# Altium project WiCAN.PrjPcb
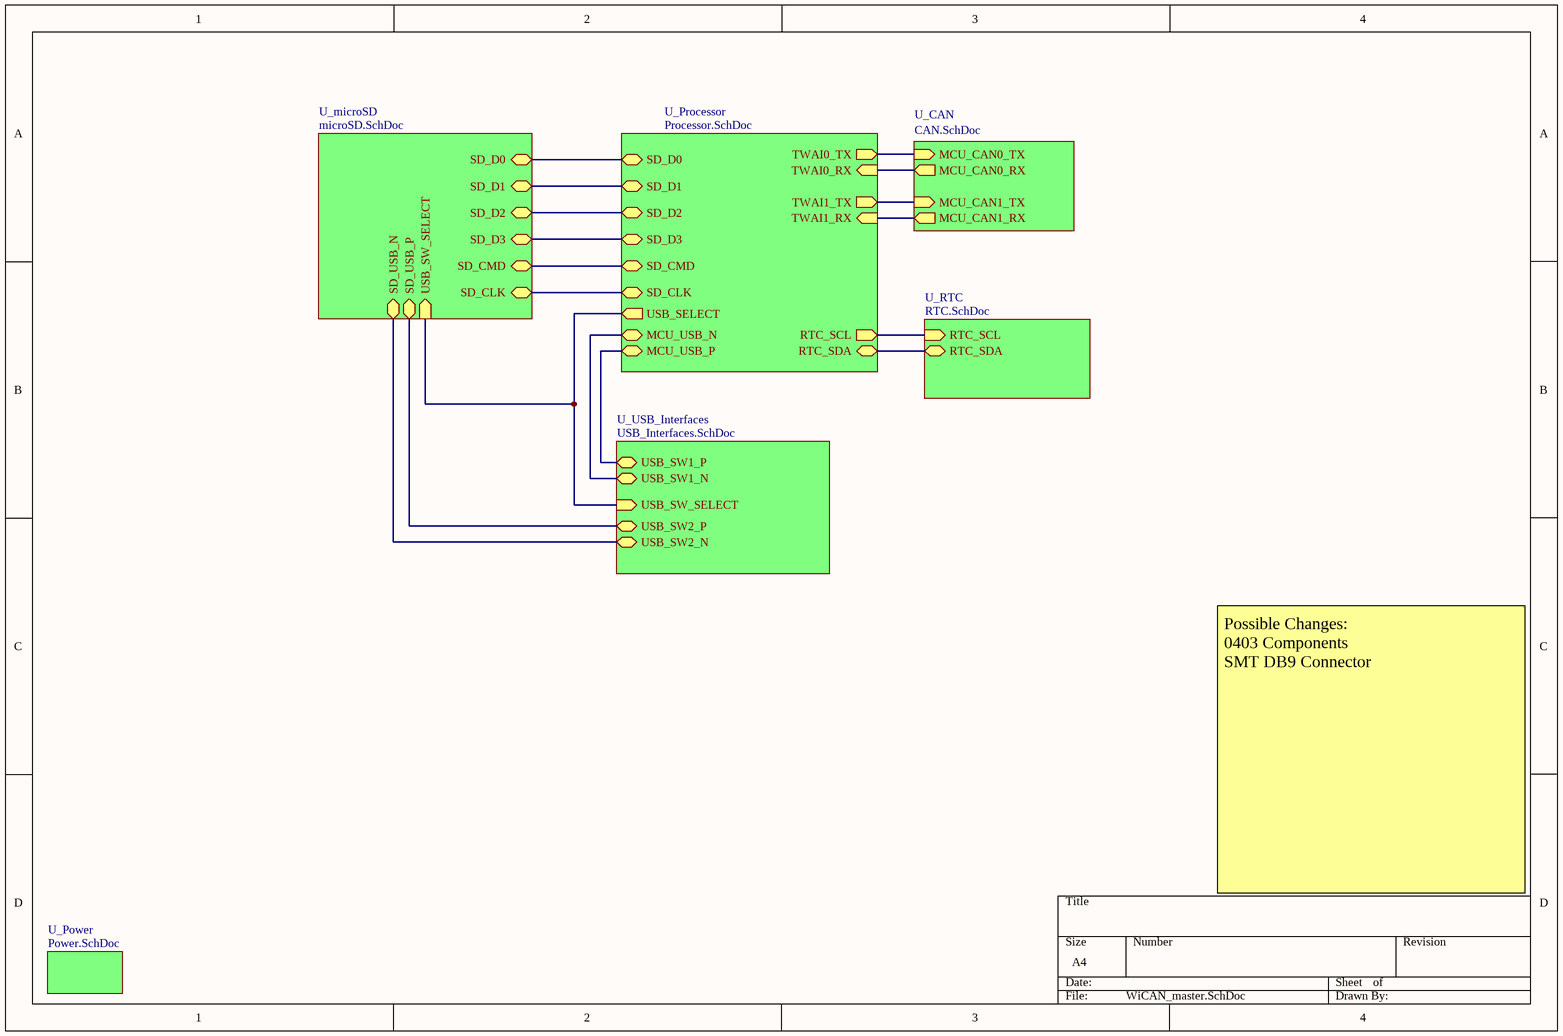
[diagram p0: WiCAN_master.SchDoc]
7 sheets, 77 parts. Net scope: hierarchical (ports join the sheet entries above them; power ports are global).
Sheets:
  WiCAN_master.SchDoc
    U_Processor = Processor.SchDoc
    U_microSD = microSD.SchDoc
    U_CAN = CAN.SchDoc
    U_RTC = RTC.SchDoc
    U_USB_Interfaces = USB_Interfaces.SchDoc
    U_Power = Power.SchDoc

## Sheet WiCAN_master.SchDoc
size A4; SheetNumber: 1; SheetTotal: 6

### Sub-sheets
U_CAN = CAN.SchDoc: MCU_CAN0_TX (in), MCU_CAN0_RX (out), MCU_CAN1_TX (in), MCU_CAN1_RX (out)
U_microSD = microSD.SchDoc: SD_D0 (bidir), SD_D1 (bidir), SD_D2 (bidir), SD_D3 (bidir), SD_CMD (bidir), SD_CLK (bidir), SD_USB_P (bidir), SD_USB_N (bidir), USB_SW_SELECT (in)
U_Power = Power.SchDoc: no entries
U_Processor = Processor.SchDoc: SD_D0 (bidir), SD_D1 (bidir), SD_D2 (bidir), SD_D3 (bidir), SD_CMD (bidir), SD_CLK (bidir), RTC_SDA (bidir), TWAI0_TX (out), TWAI0_RX (in), TWAI1_TX (out), TWAI1_RX (in), MCU_USB_N (bidir), MCU_USB_P (bidir), USB_SELECT (out), RTC_SCL (out)
U_RTC = RTC.SchDoc: RTC_SCL (in), RTC_SDA (bidir)
U_USB_Interfaces = USB_Interfaces.SchDoc: USB_SW2_P (bidir), USB_SW2_N (bidir), USB_SW1_P (bidir), USB_SW1_N (bidir), USB_SW_SELECT (in)

### Nets
MCU_USB_N: sheet U_Processor/MCU_USB_N, sheet U_USB_Interfaces/USB_SW1_N
MCU_USB_P: sheet U_Processor/MCU_USB_P, sheet U_USB_Interfaces/USB_SW1_P
RTC_SCL: sheet U_Processor/RTC_SCL, sheet U_RTC/RTC_SCL
RTC_SDA: sheet U_Processor/RTC_SDA, sheet U_RTC/RTC_SDA
SD_CLK: sheet U_Processor/SD_CLK, sheet U_microSD/SD_CLK
SD_CMD: sheet U_Processor/SD_CMD, sheet U_microSD/SD_CMD
SD_D0: sheet U_Processor/SD_D0, sheet U_microSD/SD_D0
SD_D1: sheet U_Processor/SD_D1, sheet U_microSD/SD_D1
SD_D2: sheet U_Processor/SD_D2, sheet U_microSD/SD_D2
SD_D3: sheet U_Processor/SD_D3, sheet U_microSD/SD_D3
SD_RESET_N: sheet U_Processor/USB_SELECT, sheet U_microSD/USB_SW_SELECT, sheet U_USB_Interfaces/USB_SW_SELECT
SD_USB_N: sheet U_microSD/SD_USB_N, sheet U_USB_Interfaces/USB_SW2_N
SD_USB_P: sheet U_microSD/SD_USB_P, sheet U_USB_Interfaces/USB_SW2_P
NetIC1_9: sheet U_Processor/TWAI0_TX, sheet U_CAN/MCU_CAN0_TX
NetIC1_10: sheet U_Processor/TWAI0_RX, sheet U_CAN/MCU_CAN0_RX
NetIC1_12: sheet U_Processor/TWAI1_TX, sheet U_CAN/MCU_CAN1_TX
NetIC1_13: sheet U_Processor/TWAI1_RX, sheet U_CAN/MCU_CAN1_RX

### Notes on the sheet
- Possible Changes:
  0403 Components
  SMT DB9 Connector

## Sheet Processor.SchDoc
size A4; SheetNumber: 2; SheetTotal: 7; SPICEModelCacheYJUROCZO: <root> / <DocumentId>YJUROCZO</DocumentId> / <CacheFrame Number="0"> / <Model Name="umk107bj105_a-t" Kind="CKT"> / <Text>* UMK107BJ105_A-T     SPICE MODEL  ( General Type ) / *-------------------------------------------------------------------------------------------------------- / * Model Generated by TAIYO YUDEN Corporation (http://www.ty-top.com) / * Version 1.0 / * TAIYO YUDEN Control No. 170508_130520 / * Copyright(c) 2012 TAIYO YUDEN CO.,LTD. All Rights Reserved. / *-------------------------------------------------------------------------------------------------------- / * / * Products Name : Multilayer Ceramic Capacitors / * / * Characteristics : / *     Capacitance : 1 uF , Rated Voltage : 50V , TCC : X5R / *     Case Size : 1.6 x 0.8 / 0.063 x 0.031 [mm/inch] , Thickness : 0.8 / 0.031 [mm/inch] / *     (Conditions: Temperature = 25 degC , DC Bias Current/Voltage = 0A / 0V) / * / * Frequency Range : 40Hz - 3GHz / * / * External Node Assignments : / * / *  1  o---| |---o  2 / * / *-------------------------------------------------------------------------------------------------------- / .SubCkt UMK107BJ105_A-T 1 2 / **************************** / C0 1 110 0.79929u / Cm 1 101 0.13681u / C1 101 102 0.26224u / Rc1 101 102 5.8806k / C2 102 103 0.057839u / Rc2 102 103 469.42 / C3 103 110 0.014568u / Rc3 103 110 14.853 / C2m 1 301 0.13283u / C21 301 302 1.2593u / Rc21 301 302 6.3079k / C22 302 303 1.1189u / Rc22 302 303 6.9405k / C23 303 304 1.1421u / Rc23 303 304 6.4848k / C24 304 305 0.36861u / Rc24 304 305 785 / C25 305 306 0.39327u / Rc25 305 306 637.41 / C26 306 307 0.27451u / Rc26 306 307 19.365 / C27 307 308 0.15295u / Rc27 307 308 23.239 / C28 308 309 0.17569u / Rc28 308 309 17.788 / C29 309 110 1420.6p / Rc29 309 110 1.9725 / Rp0 1 110 500Meg / L0 110 120 0.24088n / Lm 120 130 0.1369n / L1 120 121 0.1842n / RL1 121 130 0.29804 / L2 120 122 0.40657n / RL2 122 130 0.57395 / L3 120 123 0.85773n / RL3 123 130 0.82282 / CR 120 124 0.11463u / LR 124 125 0.25983n / RR 125 130 52.447m / CL 130 140 1.4637p / LL 130 140 0.23986n / RL 130 140 33.985 / Rs 140 2 6.8539m / **************************** / .ends UMK107BJ105_A-T</Text> / </Model> / </CacheFrame> / </root>
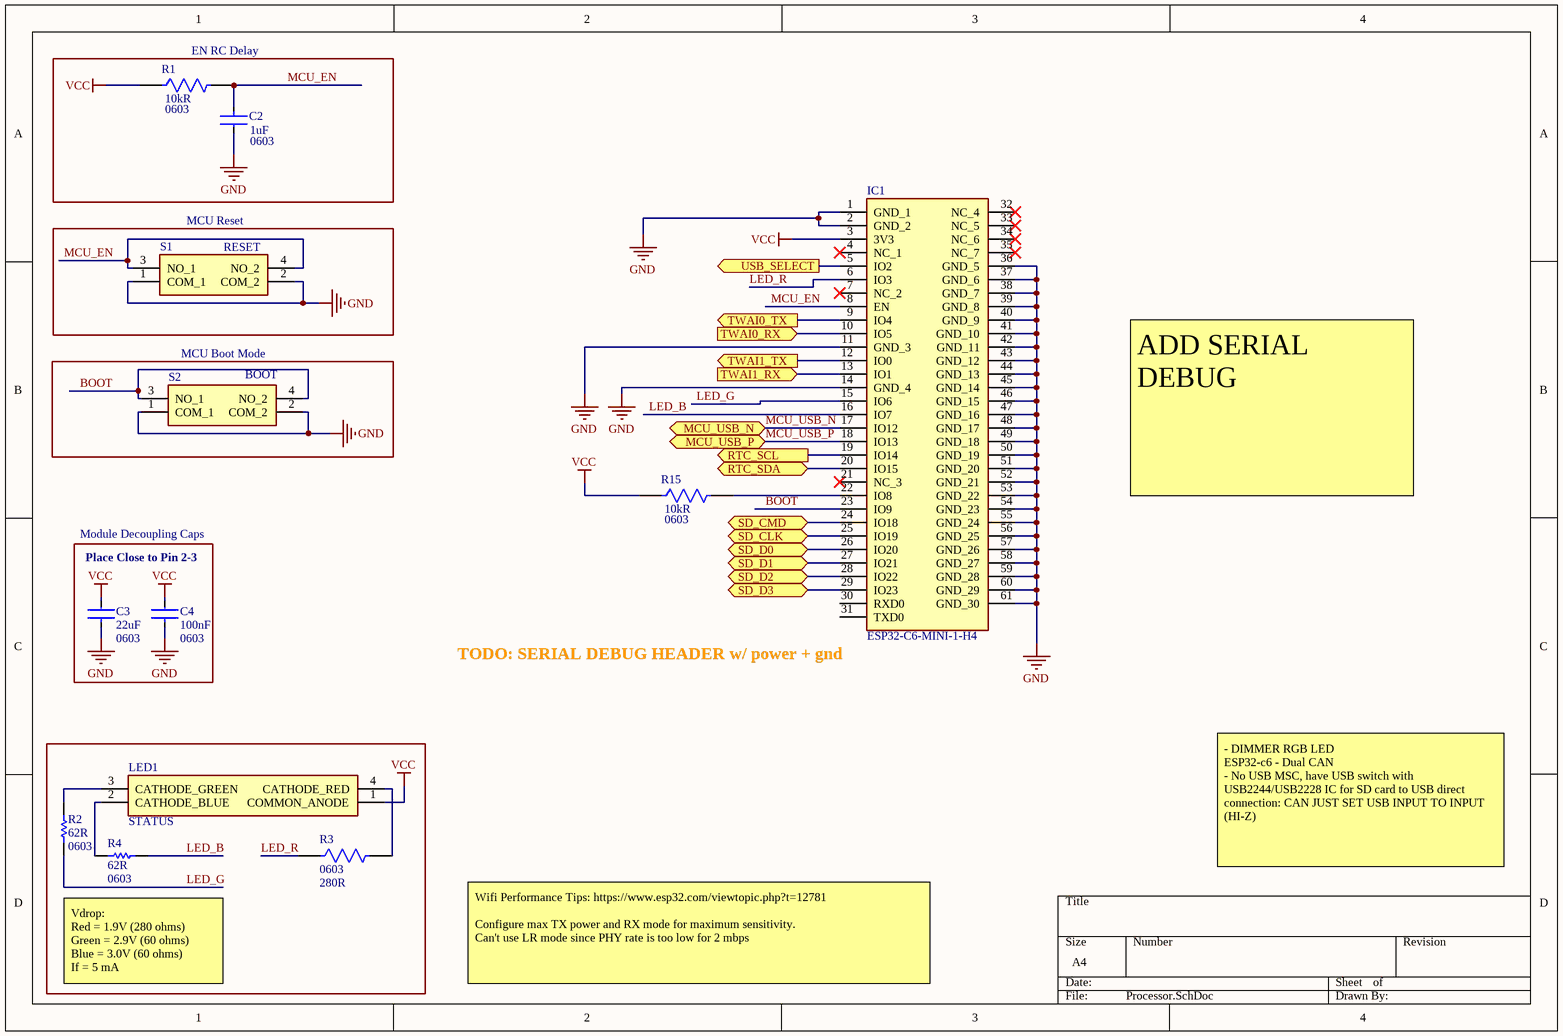
[diagram p1: Processor.SchDoc]

### Parts
C2  Case/Package: 0603  Capacitance: 1uF  [FP-0603-L_1_6_0_1-W_0_8_0-IPC_A]  (hidden comment: UMK107BJ105KA-T)
C3  Capacitance: 22uF  Case Code (Imperial): 0603  [FP-GRM188-0_2-IPC_C]  (hidden comment: GRM188R61A226ME15D)
C4  Capacitance: 100nF  Case/Package: 0603  [FP-CL10-IPC_A]  (hidden comment: CL10B104KB8WPNC)
IC1  ESP32-C6-MINI-1-H4  [ESP32C6MINI1H4]
LED1  STATUS  [CLMVCFKACL1D1L71BB7C3C3]
R1  Case Code (Imperial): 0603  Resistance: 10kR  [FP-RMCF0603-MFG]  (hidden comment: RMCF0603JG10K0)
R2  Resistance: 62R  Package: 0603  [RESC1608X55X30ML15T15]  (hidden comment: ERJ-3GEYJ620V)
R3  Case/Package: 0603  Resistance: 280R  [FP-RMCF0603-MFG]  (hidden comment: RMCF0603FT280R)
R4  Resistance: 62R  Package: 0603  [RESC1608X55X30ML15T15]  (hidden comment: ERJ-3GEYJ620V)
R15  Case Code (Imperial): 0603  Resistance: 10kR  [FP-RMCF0603-MFG]  (hidden comment: RMCF0603JG10K0)
S1  RESET  [PTS526SM15SMTR2LFS]
S2  BOOT  [PTS526SM15SMTR2LFS]

### Blocks framed on the sheet
EN RC Delay: C2 R1
MCU Reset: S1
MCU Boot Mode: S2

### Ports
MCU_USB_N (bidir), MCU_USB_P (bidir), RTC_SCL (out), RTC_SDA (bidir), SD_CLK (bidir), SD_CMD (bidir), SD_D0 (bidir), SD_D1 (bidir), SD_D2 (bidir), SD_D3 (bidir), TWAI0_RX (in), TWAI0_TX (out), TWAI1_RX (in), TWAI1_TX (out), USB_SELECT (out)

### Nets
GND: C2.2 C3.1 C4.1 IC1.1(GND_1) IC1.2(GND_2) IC1.11(GND_3) IC1.14(GND_4) IC1.36(GND_5) IC1.37(GND_6) IC1.38(GND_7) IC1.39(GND_8) IC1.40(GND_9) IC1.41(GND_10) IC1.42(GND_11) IC1.43(GND_12) IC1.44(GND_13) IC1.45(GND_14) IC1.46(GND_15) IC1.47(GND_16) IC1.48(GND_17) IC1.49(GND_18) IC1.50(GND_19) IC1.51(GND_20) IC1.52(GND_21) IC1.53(GND_22) IC1.54(GND_23) IC1.55(GND_24) IC1.56(GND_25) IC1.57(GND_26) IC1.58(GND_27) IC1.59(GND_28) IC1.60(GND_29) IC1.61(GND_30) S1.1(COM_1) S1.2(COM_2) S2.1(COM_1) S2.2(COM_2)
VCC: C3.2 C4.2 IC1.3(3V3) LED1.1(COMMON_ANODE) R1.1 R15.1
BOOT: IC1.23(IO9) S2.3(NO_1) S2.4(NO_2)
LED_B: IC1.16(IO7) R4.2
LED_G: IC1.15(IO6) R2.2
LED_R: IC1.6(IO3) R3.1
MCU_EN: C2.1 IC1.8(EN) R1.2 S1.3(NO_1) S1.4(NO_2)
MCU_USB_N: IC1.17(IO12) ; port MCU_USB_N
MCU_USB_P: IC1.18(IO13) ; port MCU_USB_P
RTC_SCL: IC1.19(IO14) ; port RTC_SCL
RTC_SDA: IC1.20(IO15) ; port RTC_SDA
SD_CLK: IC1.25(IO19) ; port SD_CLK
SD_CMD: IC1.24(IO18) ; port SD_CMD
SD_D0: IC1.26(IO20) ; port SD_D0
SD_D1: IC1.27(IO21) ; port SD_D1
SD_D2: IC1.28(IO22) ; port SD_D2
SD_D3: IC1.29(IO23) ; port SD_D3
SD_RESET_N: IC1.5(IO2) ; port USB_SELECT
NetIC1_9: IC1.9(IO4) ; port TWAI0_TX
NetIC1_10: IC1.10(IO5) ; port TWAI0_RX
NetIC1_12: IC1.12(IO0) ; port TWAI1_TX
NetIC1_13: IC1.13(IO1) ; port TWAI1_RX
NetIC1_22: IC1.22(IO8) R15.2
NetLED1_2: LED1.2(CATHODE_BLUE) R4.1
NetLED1_3: LED1.3(CATHODE_GREEN) R2.1
NetLED1_4: LED1.4(CATHODE_RED) R3.2

Not connected (* = marked no-connect by the designer): IC1 4(NC_1)* 7(NC_2)* 21(NC_3)* 30(RXD0) 31(TXD0) 32(NC_4)* 33(NC_5)* 34(NC_6)* 35(NC_7)*

### Notes on the sheet
- ADD SERIAL DEBUG
- Module Decoupling Caps
- Place Close to Pin 2-3
- TODO: SERIAL DEBUG HEADER w/ power + gnd
- - DIMMER RGB LED
  ESP32-c6 - Dual CAN
  - No USB MSC, have USB switch with USB2244/USB2228 IC for SD card to USB direct connection: CAN JUST SET USB INPUT TO INPUT (HI-Z)
- Vdrop:
  Red = 1.9V (280 ohms)
  Green = 2.9V (60 ohms)
  Blue = 3.0V (60 ohms)
  If = 5 mA
- Wifi Performance Tips: https://www.esp32.com/viewtopic.php?t=12781
  Configure max TX power and RX mode for maximum sensitivity.
  Can't use LR mode since PHY rate is too low for 2 mbps

### Library data of the parts
C2 = CMP-2000-05447-3: None; Tolerance: 10%; Voltage Rating: 50V; Dielectric: X5R; Height: 0.8mm; Depth: 0.8mm; Number of Pins: 2; Length: 1.6mm; Thickness: 0.035inch; Contact Plating: Nickel; Radiation Hardening: No; Package Quantity: 1; Halogen Free: Halogen Free; RoHS Compliant: Yes; Termination: SMD/SMT; Max Operating Temperature: 85°C; Min Operating Temperature: -55°C; Case Code (Metric): 1608; Construction: Flat; Voltage Rating (DC): 50V; Packaging: Tape and Reel; Series: M; Case Code (Imperial): 0603; Width: 0.031inch; Mount: Surface Mount
C3 = CMP-2000-06337-3: Chip Multilayer Ceramic Capacitors for General Purpose, 0603, 22uF, X5R, 15%, 20%, 10V; Tolerance: 20%; Weight: 0.000222oz; Material: Ceramic; Depth: 0.8mm; Length: 1.6mm; Termination: SMD/SMT; Packaging: Tape and Reel; Width: 0.8mm; Voltage Rating: 10V; Mount: Surface Mount; Voltage Rating (DC): 10V; Case/Package: 0603; Thickness: 0.039inch; REACH SVHC: No SVHC; Dielectric: X5R; Height: 0.8mm; Package Quantity: 4000; Case Code (Metric): 1608; Min Operating Temperature: -55°C; Lead Free: Lead Free; Max Operating Temperature: 85°C
C4 = CMP-13271-002353-1: Cap Ceramic 100nF 50V X7R ±10% Pad SMD 0603 +125°C T/R; Ratings: AEC-Q200; Features: Soft Termination; Max Operating Temperature: 125°C; Mount: Surface Mount; Width: 0.031inch; Voltage Rating: 50V; Case Code (Metric): 1608; Case Code (Imperial): 0603; Tolerance: 10%; Min Operating Temperature: -55°C; Thickness: 0.035inch; Lead Free: Lead Free; Packaging: Tape and Reel; Length: 0.063inch
IC1 = ESP32-C6-MINI-1-H4: Integrated Circuit; Manufacturer_Name: Espressif Systems; Datasheet Link: https://www.espressif.com/sites/default/files/documentation/esp32-c6-mini-1_mini-1u_datasheet_en.pdf; Height: 2.55mm; Manufacturer_Part_Number: ESP32-C6-MINI-1-H4; Mouser Part Number: 356-ESP32C6MINI1-H4; Mouser Price/Stock: https://www.mouser.co.uk/ProductDetail/Espressif-Systems/ESP32-C6-MINI-1-H4?qs=Jm2GQyTW%2Fbgg5ClQiAJNHw%3D%3D
LED1 = CLMVC-FKA-CL1D1L71BB7C3C3: LED; Manufacturer_Name: Wolfspeed; Datasheet Link: https://www.cree.com/led-components/media/documents/1273-CLMVC-FKA.pdf; Height: 1mm; Manufacturer_Part_Number: CLMVC-FKA-CL1D1L71BB7C3C3; Mouser Part Number: 941-CLMVCFKACL1D1L71; Mouser Price/Stock: https://www.mouser.co.uk/ProductDetail/Cree-LED/CLMVC-FKA-CL1D1L71BB7C3C3?qs=fSnNYG2PaKLJAXXrLOgMiQ%3D%3D; Arrow Part Number: CLMVC-FKA-CL1D1L71BB7C3C3; Arrow Price/Stock: https://www.arrow.com/en/products/clmvc-fka-cl1d1l71bb7c3c3/cree-led?region=nac
R1 R15 = CMP-26527-000153-1: 10kΩ ±5% 0.1W 0603 Thick Film Chip Resistor AEC-Q200 compliant; Temperature Coefficient: 200ppm/°C; Max Power Dissipation: 100mW; Tolerance: 5%; Series: RMCF; Resistor Type: Thick Film; Length: 0.061inch; Features: Automotive AEC-Q200; Height: 0.022inch; Case Code (Metric): 1608; Width: 0.031inch; Number of Terminations: 2; Contact Plating: Tin; Case/Package: 0603; Package Quantity: 1; Max Operating Temperature: 155°C; Mount: Surface Mount; RoHS Compliant: Yes; Radiation Hardening: No; Min Operating Temperature: -55°C; Packaging: Tape and Reel
R2 R4 = CMP-1012-00045-2: Manufacturer: Panasonic; Part Number: ERJ-3GEYJ620V
R3 = CMP-26527-006784-1: 280Ω ±1% 0.1W 0603 Thick Film Chip Resistor AEC-Q200 compliant; Max Power Dissipation: 100mW; Temperature Coefficient: 100ppm/°C; RoHS Compliant: Yes; Height: 0.022inch; Resistor Type: Thick Film; Case Code (Metric): 1608; Radiation Hardening: No; Contact Plating: Tin; Series: RMCF; Features: Automotive AEC-Q200; Number of Terminations: 2; Tolerance: 1%; Packaging: Tape and Reel; Max Operating Temperature: 155°C; Min Operating Temperature: -55°C; Length: 0.061inch; Lead Free: Lead Free; Width: 0.031inch; Mount: Surface Mount; Case Code (Imperial): 0603
S1 S2 = PTS526_SM15_SMTR2_LFS: Switch; Manufacturer_Name: C & K COMPONENTS; Manufacturer_Part_Number: PTS526 SM15 SMTR2 LFS; Datasheet Link: https://www.mouser.com/datasheet/2/60/pts526-1651200.pdf; Height: 1.5mm; Mouser Part Number: 611-PTS526SM15SMTR2L; Mouser Price/Stock: https://www.mouser.co.uk/ProductDetail/CK/PTS526-SM15-SMTR2-LFS?qs=UXgszm6BlbENivbslIA%252B5g%3D%3D; Arrow Part Number: PTS526 SM15 SMTR2 LFS; Arrow Price/Stock: https://www.arrow.com/en/products/pts526-sm15-smtr2-lfs/ck?region=nac

## Sheet microSD.SchDoc
size A4; SheetNumber: 6; SheetTotal: 6; SPICEModelCacheQHUFGKIC: <root> / <DocumentId>QHUFGKIC</DocumentId> / <CacheFrame Number="0"> / <Model Name="umk107bj105_a-t" Kind="CKT"> / <Text>* UMK107BJ105_A-T     SPICE MODEL  ( General Type ) / *-------------------------------------------------------------------------------------------------------- / * Model Generated by TAIYO YUDEN Corporation (http://www.ty-top.com) / * Version 1.0 / * TAIYO YUDEN Control No. 170508_130520 / * Copyright(c) 2012 TAIYO YUDEN CO.,LTD. All Rights Reserved. / *-------------------------------------------------------------------------------------------------------- / * / * Products Name : Multilayer Ceramic Capacitors / * / * Characteristics : / *     Capacitance : 1 uF , Rated Voltage : 50V , TCC : X5R / *     Case Size : 1.6 x 0.8 / 0.063 x 0.031 [mm/inch] , Thickness : 0.8 / 0.031 [mm/inch] / *     (Conditions: Temperature = 25 degC , DC Bias Current/Voltage = 0A / 0V) / * / * Frequency Range : 40Hz - 3GHz / * / * External Node Assignments : / * / *  1  o---| |---o  2 / * / *-------------------------------------------------------------------------------------------------------- / .SubCkt UMK107BJ105_A-T 1 2 / **************************** / C0 1 110 0.79929u / Cm 1 101 0.13681u / C1 101 102 0.26224u / Rc1 101 102 5.8806k / C2 102 103 0.057839u / Rc2 102 103 469.42 / C3 103 110 0.014568u / Rc3 103 110 14.853 / C2m 1 301 0.13283u / C21 301 302 1.2593u / Rc21 301 302 6.3079k / C22 302 303 1.1189u / Rc22 302 303 6.9405k / C23 303 304 1.1421u / Rc23 303 304 6.4848k / C24 304 305 0.36861u / Rc24 304 305 785 / C25 305 306 0.39327u / Rc25 305 306 637.41 / C26 306 307 0.27451u / Rc26 306 307 19.365 / C27 307 308 0.15295u / Rc27 307 308 23.239 / C28 308 309 0.17569u / Rc28 308 309 17.788 / C29 309 110 1420.6p / Rc29 309 110 1.9725 / Rp0 1 110 500Meg / L0 110 120 0.24088n / Lm 120 130 0.1369n / L1 120 121 0.1842n / RL1 121 130 0.29804 / L2 120 122 0.40657n / RL2 122 130 0.57395 / L3 120 123 0.85773n / RL3 123 130 0.82282 / CR 120 124 0.11463u / LR 124 125 0.25983n / RR 125 130 52.447m / CL 130 140 1.4637p / LL 130 140 0.23986n / RL 130 140 33.985 / Rs 140 2 6.8539m / **************************** / .ends UMK107BJ105_A-T</Text> / </Model> / </CacheFrame> / </root>
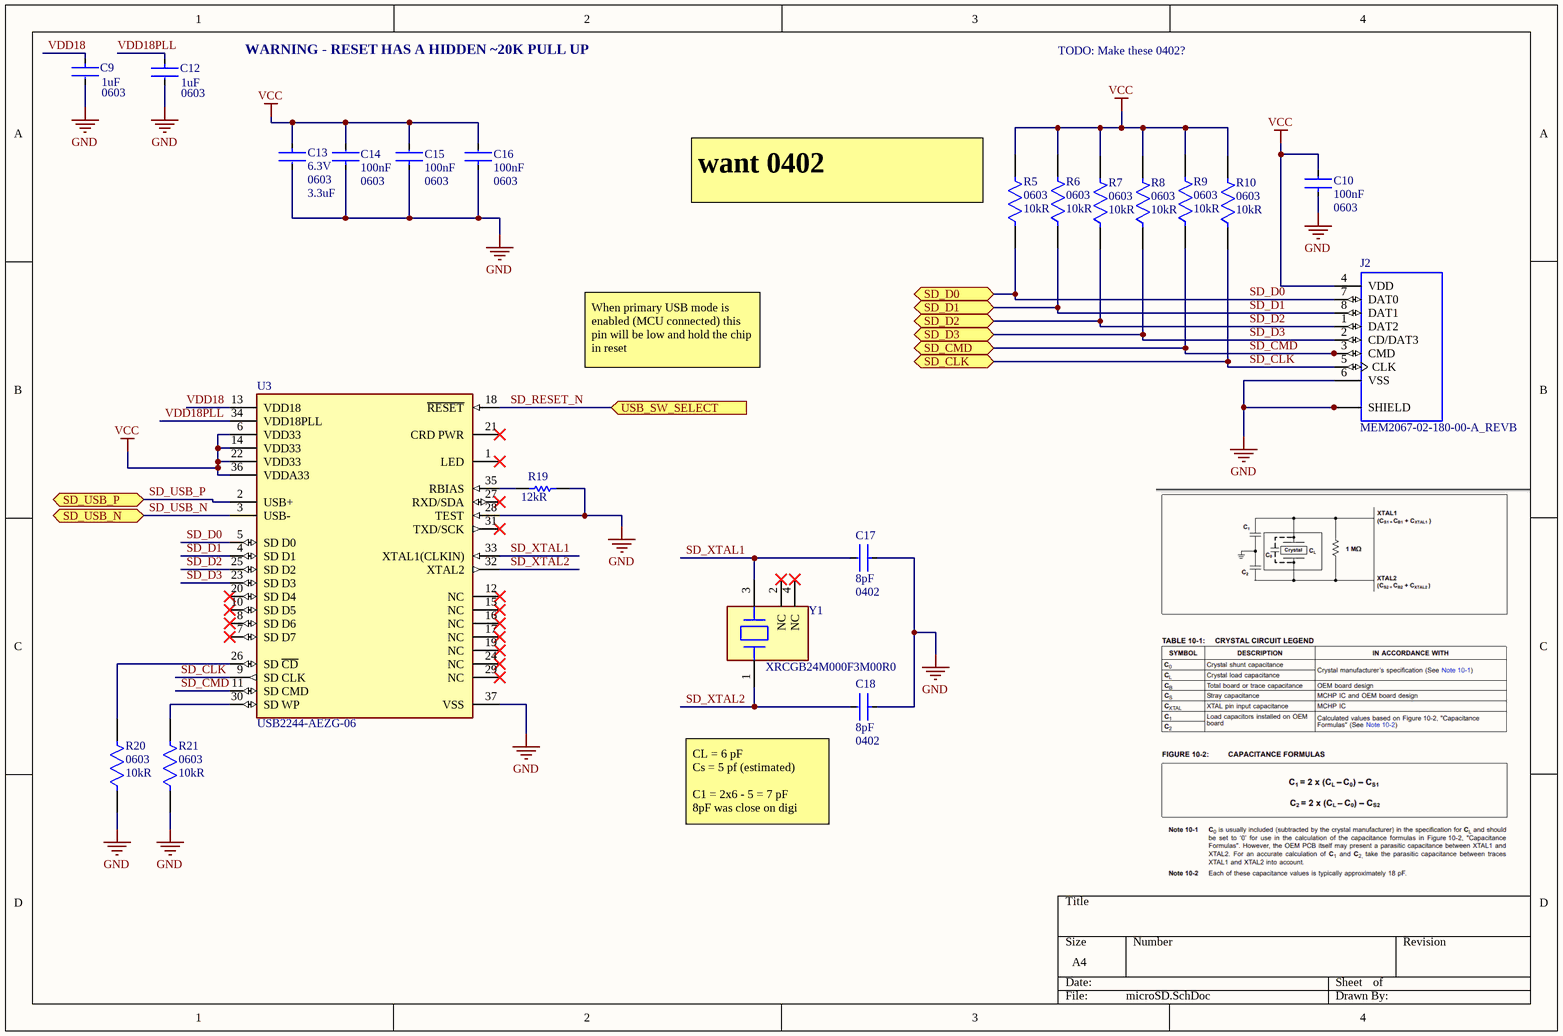
[diagram p2: microSD.SchDoc]

### Parts
C9  Case/Package: 0603  Capacitance: 1uF  [FP-0603-L_1_6_0_1-W_0_8_0-IPC_A]  (hidden comment: UMK107BJ105KA-T)
C10  Capacitance: 100nF  Case/Package: 0603  [FP-CL10-IPC_A]  (hidden comment: CL10B104KB8WPNC)
C12  Case/Package: 0603  Capacitance: 1uF  [FP-0603-L_1_6_0_1-W_0_8_0-IPC_A]  (hidden comment: UMK107BJ105KA-T)
C13  Voltage Rating: 6.3V  Case Code (Imperial): 0603  Capacitance: 3.3uF  [FP-C1608-080-0_1-MFG]  (hidden comment: C1608X7S0J335K080AC)
C14  Capacitance: 100nF  Case/Package: 0603  [FP-CL10-IPC_A]  (hidden comment: CL10B104KB8WPNC)
C15  Capacitance: 100nF  Case/Package: 0603  [FP-CL10-IPC_A]  (hidden comment: CL10B104KB8WPNC)
C16  Capacitance: 100nF  Case/Package: 0603  [FP-CL10-IPC_A]  (hidden comment: CL10B104KB8WPNC)
C17  Capacitance: 8pF  Package: 0402  [FP-CL522-IPC_C]  (hidden comment: CL05C080DB51PNC)
C18  Capacitance: 8pF  Package: 0402  [FP-CL522-IPC_C]  (hidden comment: CL05C080DB51PNC)
J2  MEM2067-02-180-00-A_REVB  [GCT_MEM2067-02-180-00-A_REVB]
R5  Case Code (Imperial): 0603  Resistance: 10kR  [FP-RMCF0603-MFG]  (hidden comment: RMCF0603JG10K0)
R6  Case Code (Imperial): 0603  Resistance: 10kR  [FP-RMCF0603-MFG]  (hidden comment: RMCF0603JG10K0)
R7  Case Code (Imperial): 0603  Resistance: 10kR  [FP-RMCF0603-MFG]  (hidden comment: RMCF0603JG10K0)
R8  Case Code (Imperial): 0603  Resistance: 10kR  [FP-RMCF0603-MFG]  (hidden comment: RMCF0603JG10K0)
R9  Case Code (Imperial): 0603  Resistance: 10kR  [FP-RMCF0603-MFG]  (hidden comment: RMCF0603JG10K0)
R10  Case Code (Imperial): 0603  Resistance: 10kR  [FP-RMCF0603-MFG]  (hidden comment: RMCF0603JG10K0)
R19  Resistance: 12kR  [RESC1608X55X25LL10T15]  (hidden comment: RC0603FR-1312KL)
R20  Case Code (Imperial): 0603  Resistance: 10kR  [FP-RMCF0603-MFG]  (hidden comment: RMCF0603JG10K0)
R21  Case Code (Imperial): 0603  Resistance: 10kR  [FP-RMCF0603-MFG]  (hidden comment: RMCF0603JG10K0)
U3  USB2244-AEZG-06  [FP-36QFN-4106-6x6B-MFG]
Y1  XRCGB24M000F3M00R0  [FP-XRCGB_F_N-MFG]

### Ports
SD_CLK (bidir), SD_CMD (bidir), SD_D0 (bidir), SD_D1 (bidir), SD_D2 (bidir), SD_D3 (bidir), SD_USB_N (bidir), SD_USB_P (bidir), USB_SW_SELECT (in)

### Nets
GND: C9.2 C10.1 C12.2 C13.1 C14.1 C15.1 C16.1 C17.1 C18.1 J2.6(VSS) J2.9(SHIELD) J2.10(SHIELD) J2.11(SHIELD) J2.12(SHIELD) R19.2 R20.1 R21.1 U3.28(TEST) U3.37(VSS)
VCC: C10.2 C13.2 C14.2 C15.2 C16.2 J2.4(VDD) R5.2 R6.2 R7.2 R8.2 R9.2 R10.2 U3.6(VDD33) U3.14(VDD33) U3.22(VDD33) U3.36(VDDA33)
SD_CLK: J2.5(CLK) R10.1 U3.9(SD_CLK) ; port SD_CLK
SD_CMD: J2.3(CMD) R9.1 U3.11(SD_CMD) ; port SD_CMD
SD_D0: J2.7(DAT0) R5.1 U3.5(SD_D0) ; port SD_D0
SD_D1: J2.8(DAT1) R6.1 U3.4(SD_D1) ; port SD_D1
SD_D2: J2.1(DAT2) R7.1 U3.25(SD_D2) ; port SD_D2
SD_D3: J2.2(CD/DAT3) R8.1 U3.23(SD_D3) ; port SD_D3
SD_RESET_N: U3.18(~{RESET}) ; port USB_SW_SELECT
SD_USB_N: U3.3(USB-) ; port SD_USB_N
SD_USB_P: U3.2(USB+) ; port SD_USB_P
SD_XTAL1: C17.2 U3.33(XTAL1(CLKIN)) Y1.3(2_Input/Output)
SD_XTAL2: C18.2 U3.32(XTAL2) Y1.1(1_Input/Output)
VDD18: C9.1 U3.13(VDD18)
VDD18PLL: C12.1 U3.34(VDD18PLL)
NetR19_1: R19.1 U3.35(RBIAS)
NetR20_2: R20.2 U3.26(SD_~{CD})
NetR21_2: R21.2 U3.30(SD_WP)

Not connected (* = marked no-connect by the designer): U3 1(LED)* 7(SD_D7)* 8(SD_D6)* 10(SD_D5)* 12(NC)* 15(NC)* 16(NC)* 17(NC)* 19(NC)* 20(SD_D4)* 21(CRD_PWR)* 24(NC)* 27(RXD/SDA)* 29(NC)* 31(TXD/SCK)*; Y1 2(NC)* 4(NC)*

### Notes on the sheet
- WARNING - RESET HAS A HIDDEN ~20K PULL UP
- TODO: Make these 0402?
- (near R5) want 0402
- When primary USB mode is enabled (MCU connected) this pin will be low and hold the chip in reset
- (near C18) CL = 6 pF
  Cs = 5 pf (estimated)
  C1 = 2x6 - 5 = 7 pF
  8pF was close on digi

### Library data of the parts
C9 C12 = CMP-2000-05447-3: as C2 on sheet Processor; Height: 0.8mm; Depth: 0.8mm; Number of Pins: 2; Length: 1.6mm; Thickness: 0.035inch; Contact Plating: Nickel; Radiation Hardening: No; Package Quantity: 1; Halogen Free: Halogen Free; RoHS Compliant: Yes; Termination: SMD/SMT; Max Operating Temperature: 85°C; Min Operating Temperature: -55°C; Case Code (Metric): 1608; Construction: Flat; Voltage Rating (DC): 50V; Packaging: Tape and Reel; Series: M; Case Code (Imperial): 0603; Width: 0.031inch; Mount: Surface Mount
C10 C14-C16 = CMP-13271-002353-1: as C4 on sheet Processor; Ratings: AEC-Q200; Features: Soft Termination; Max Operating Temperature: 125°C; Mount: Surface Mount; Width: 0.031inch; Voltage Rating: 50V; Case Code (Metric): 1608; Case Code (Imperial): 0603; Tolerance: 10%; Min Operating Temperature: -55°C; Thickness: 0.035inch; Lead Free: Lead Free; Packaging: Tape and Reel; Length: 0.063inch
C13 = CMP-08246-006760-1: Multilayer Ceramic Capacitors 3.3μF ±10% 6.3V X7S SMD 0603; Max Operating Temperature: 125°C; Lead Free: Lead Free; Min Operating Temperature: -55°C; Dielectric Material: Ceramic; Voltage Rating (DC): 6.3V; Case/Package: 0603; Thickness: 0.035inch; RoHS Compliant: Yes; Mount: Surface Mount; Width: 0.031inch; Tolerance: 10%; Case Code (Metric): 1608; Package Quantity: 4000; Series: C; Length: 0.063inch; Packaging: Tape and Reel
C17 C18 = CMP-13271-000662-1: Cap Ceramic 8pF 50V C0G ±0.5pF SMD 0402 +125°C Paper T/R
J2 = MEM2067-02-180-00-A_REVB: Micro SD Memory Card ConnectorSMT, Hinged, 1.80mm Profile; Value: *; MP: MEM2067-02-180-00-A_REVB; Package: None; Availability: Unavailable; Price: None
R5-R10 R20 R21 = CMP-26527-000153-1: as R1 on sheet Processor; Tolerance: 5%; Series: RMCF; Resistor Type: Thick Film; Length: 0.061inch; Features: Automotive AEC-Q200; Height: 0.022inch; Case Code (Metric): 1608; Width: 0.031inch; Number of Terminations: 2; Contact Plating: Tin; Case/Package: 0603; Package Quantity: 1; Max Operating Temperature: 155°C; Mount: Surface Mount; RoHS Compliant: Yes; Radiation Hardening: No; Min Operating Temperature: -55°C; Packaging: Tape and Reel
R19 = CMP-2000-04198-1: Manufacturer: Yageo; Part Number: RC0603FR-1312KL
U3 = CMP-06284-000024-1: IC MEDIA CTRLR USB 2.0 36-QFNE3; Data Rate: 35Mbps; Number of Transceivers: 1; Max Supply Voltage: 3.6V; Operating Supply Voltage: 3.3V; Min Supply Voltage: 3V; Operating Supply Current: 135mA; Interface: Serial; Mount: Surface Mount; Case/Package: QFN; Height: 0.95mm; Max Operating Temperature: 70°C; Lead Free: Lead Free; Package Quantity: 490; Width: 6.15mm; Min Operating Temperature: 0°C; Radiation Hardening: No; REACH SVHC: No SVHC; Length: 6.15mm; Number of Pins: 36; RoHS Compliant: Yes; Series: *; Packaging: Tray
Y1 = CMP-06054-000017-1: CRYSTAL 24.0000MHZ 6PF SMD; ESR (Equivalent Series Resistance): 150R; Operating Frequency: 24 MHz; Tolerance: 30ppm; Frequency: 24MHz; Frequency Stability: 40ppm; Length: 2mm; Height: 0.028inch; Lead Free: Lead Free; Min Operating Temperature: -30°C; REACH SVHC: No SVHC; RoHS Compliant: Yes; Series Resistance: 150R; Mount: Surface Mount; Packaging: Tape and Reel; Termination: SMD/SMT; Case/Package: SMD/SMT; Max Operating Temperature: 85°C; Width: 1.6mm; Number of Pins: 4; Load Capacitance: 6pF; Package Quantity: 1; Depth: 1.6mm; Frequency Tolerance: 30ppm; Series: XRCGB

## Sheet CAN.SchDoc
size A4; SheetNumber: 4; SheetTotal: 6
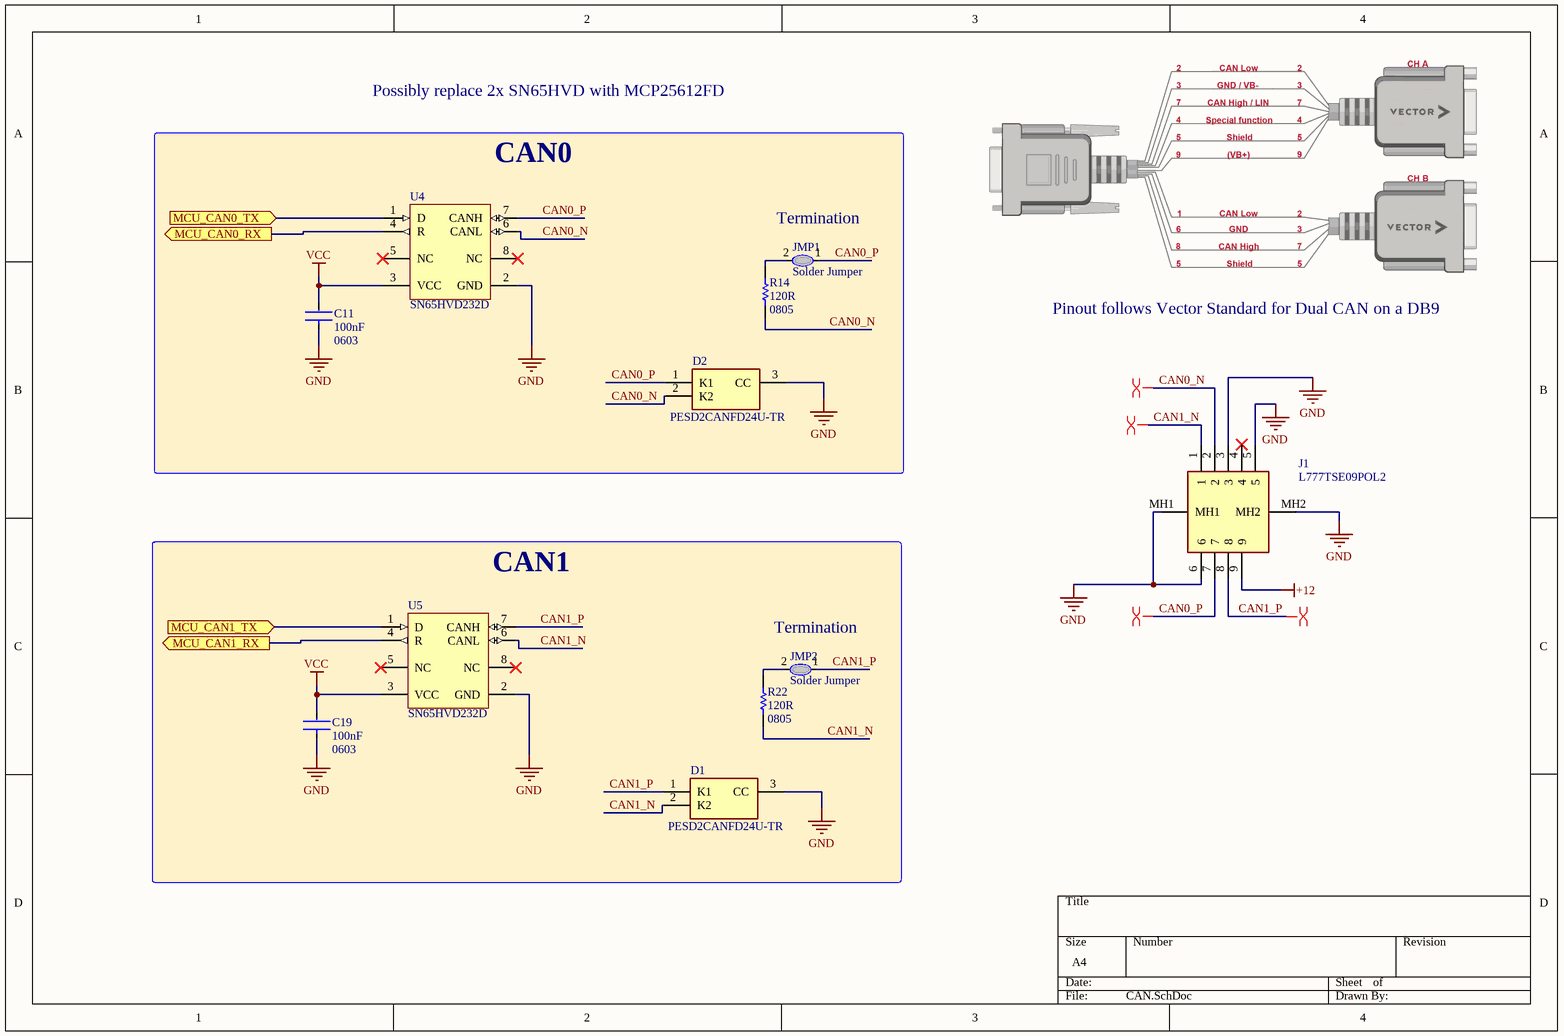
[diagram p3: CAN.SchDoc]

### Parts
C11  Capacitance: 100nF  Case/Package: 0603  [FP-CL10-IPC_A]  (hidden comment: CL10B104KB8WPNC)
C19  Capacitance: 100nF  Case/Package: 0603  [FP-CL10-IPC_A]  (hidden comment: CL10B104KB8WPNC)
D1  PESD2CANFD24U-TR  [SOT95P230X110-3N]
D2  PESD2CANFD24U-TR  [SOT95P230X110-3N]
J1  L777TSE09POL2  [L777TSE09POL2]
JMP1  Solder Jumper  [Solder Jumper]
JMP2  Solder Jumper  [Solder Jumper]
R14  Resistance: 120R  Package: 0805  [RESC2013X70X40LL20T20]  (hidden comment: ERJ-P06J121V)
R22  Resistance: 120R  Package: 0805  [RESC2013X70X40LL20T20]  (hidden comment: ERJ-P06J121V)
U4  SN65HVD232D  [D0008A_L]
U5  SN65HVD232D  [D0008A_L]

### Blocks framed on the sheet
CAN0: C11 D2 JMP1 R14 U4
CAN1: C19 D1 JMP2 R22 U5

### Ports
MCU_CAN0_RX (out), MCU_CAN0_TX (in), MCU_CAN1_RX (out), MCU_CAN1_TX (in)

### Nets
+12: J1.9
GND: C11.1 C19.1 D1.3(CC) D2.3(CC) J1.3 J1.5 J1.6 J1.MH1 J1.MH2 U4.2(GND) U5.2(GND)
VCC: C11.2 C19.2 U4.3(VCC) U5.3(VCC)
CAN0_N: D2.2(K2) J1.2 R14.2 U4.6(CANL)
CAN0_P: D2.1(K1) J1.7 JMP1.1 U4.7(CANH)
CAN1_N: D1.2(K2) J1.1 R22.2 U5.6(CANL)
CAN1_P: D1.1(K1) J1.8 JMP2.1 U5.7(CANH)
NetIC1_9: U4.1(D) ; port MCU_CAN0_TX
NetIC1_10: U4.4(R) ; port MCU_CAN0_RX
NetIC1_12: U5.1(D) ; port MCU_CAN1_TX
NetIC1_13: U5.4(R) ; port MCU_CAN1_RX
NetJMP1_2: JMP1.2 R14.1
NetJMP2_2: JMP2.2 R22.1

Not connected (* = marked no-connect by the designer): J1 4*; U4 5(NC)* 8(NC)*; U5 5(NC)* 8(NC)*

### Layout directives
differential pair: CAN0_N, CAN0_P, CAN1_N, CAN1_P

### Notes on the sheet
- Possibly replace 2x SN65HVD with MCP25612FD
- Termination
- Pinout follows Vector Standard for Dual CAN on a DB9

### Library data of the parts
C11 C19 = CMP-13271-002353-1: as C4 on sheet Processor; Ratings: AEC-Q200; Features: Soft Termination; Max Operating Temperature: 125°C; Mount: Surface Mount; Width: 0.031inch; Voltage Rating: 50V; Case Code (Metric): 1608; Case Code (Imperial): 0603; Tolerance: 10%; Min Operating Temperature: -55°C; Thickness: 0.035inch; Lead Free: Lead Free; Packaging: Tape and Reel; Length: 0.063inch
D1 D2 = PESD2CANFD24U-TR: Diode; Manufacturer_Name: Nexperia; Datasheet Link: https://assets.nexperia.com/documents/data-sheet/PESD2CANFD24U-T.pdf; Height: 1.1mm; Manufacturer_Part_Number: PESD2CANFD24U-TR; Mouser Part Number: 771-PESD2CANFD24U-TR; Mouser Price/Stock: https://www.mouser.co.uk/ProductDetail/Nexperia/PESD2CANFD24U-TR?qs=vmHwEFxEFR%252BPr2so13o7KA%3D%3D; Arrow Part Number: PESD2CANFD24U-TR; Arrow Price/Stock: https://www.arrow.com/en/products/pesd2canfd24u-tr/nexperia
J1 = L777TSE09POL2: Connector; Manufacturer_Name: Amphenol; Datasheet Link: https://cdn.amphenol-cs.com/media/wysiwyg/files/drawing/l777tsxxxpol2.pdf; Height: 12.22mm; Manufacturer_Part_Number: L777TSE09POL2; Mouser Part Number: 523-L777TSE09POL2; Mouser Price/Stock: https://www.mouser.co.uk/ProductDetail/Amphenol-Commercial-Products/L777TSE09POL2?qs=8nwx9VzGl4xjIfY3UQTpgw%3D%3D
R14 R22 = CMP-2001-00481-1: Manufacturer: Panasonic; Part Number: ERJ-P06J121V
U4 U5 = CMP-0315-00073-2: 3.3 V CAN Transceiver, 17 mA, -40 to 85 degC, 8-pin SOIC (D), Green (RoHS & no Sb/Br); Manufacturer: Texas Instruments; Supply Voltage(s)(V): 3.3; Transient Pulse Protection(V): -25 to 25; ICC(Max)(mA): 17; Drivers Per Package: 1; Rating: Catalog; Code_JEDEC: MS-012AA; Mounting Technology: Surface Mount; PackageDescription: 8-Pin Plastic Small Outline Integrated Circuit, 4.9 x 3.9 mm, Pitch 1.27 mm Pitch; SubFamily: CAN; PackageVersion: revM, Jun-2011; Isolated: No; DatasheetVersion: SLOS346K; PackageReference: D0008A; Receivers Per Package: 1; Footprint: SN65HVD232; ComponentLink1Description: Datasheet; PartNumber: SN65HVD232D; Eco-Plan: Green (RoHS & no Sb/Br); ComponentLink1URL: http://www.ti.com/general/docs/lit/getliterature.tsp?genericPartNumber=SN65HVD232&fileType=pdf

## Sheet RTC.SchDoc
size A4; SheetNumber: 4; SheetTotal: 7; SPICEModelCacheIPIYUYAV: <root> / <DocumentId>IPIYUYAV</DocumentId> / </root>
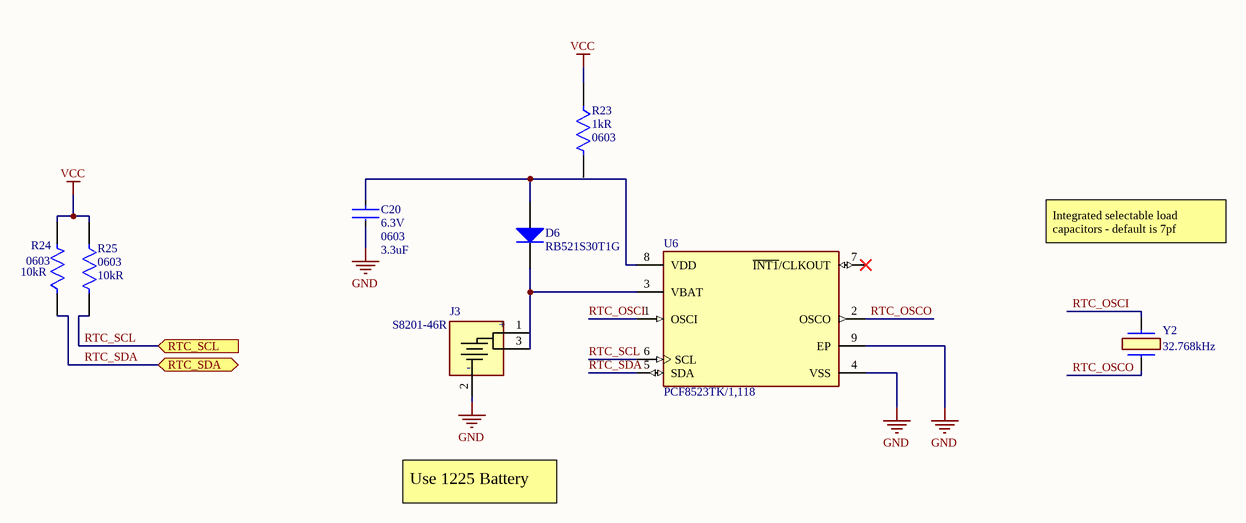
[diagram p4: RTC.SchDoc]

### Parts
C20  Voltage Rating: 6.3V  Case Code (Imperial): 0603  Capacitance: 3.3uF  [FP-C1608-080-0_1-MFG]  (hidden comment: C1608X7S0J335K080AC)
D6  RB521S30T1G  [ONSC-SOD-523-2-502-01_V]
J3  S8201-46R  [S8201-46R]
R23  Resistance: 1kR  Size Code: 0603  [FP-RC0603-0_55-IPC_C]  (hidden comment: RC0603FR-071KL)
R24  Case Code (Imperial): 0603  Resistance: 10kR  [FP-RMCF0603-MFG]  (hidden comment: RMCF0603JG10K0)
R25  Case Code (Imperial): 0603  Resistance: 10kR  [FP-RMCF0603-MFG]  (hidden comment: RMCF0603JG10K0)
U6  PCF8523TK/1,118  [FP-SOT909-1-MFG]
Y2  Frequency: 32.768kHz  [CM8V32768TA020125]  (hidden comment: CM8V-T1A-32.768kHz-7pF-20PPM-TA-QC)

### Ports
RTC_SCL (in), RTC_SDA (bidir)

### Nets
GND: C20.1 J3.2 U6.4(VSS) U6.9(EP)
VCC: R23.1 R24.2 R25.1
RTC_OSCI: U6.1(OSCI) Y2.?1
RTC_OSCO: U6.2(OSCO) Y2.2(X2)
RTC_SCL: R25.2 U6.6(SCL) ; port RTC_SCL
RTC_SDA: R24.1 U6.5(SDA) ; port RTC_SDA
NetC20_2: C20.2 D6.2(A) U6.8(VDD)
NetD6_1: D6.1(K) J3.1 J3.3 U6.3(VBAT)

Not connected (* = marked no-connect by the designer): R23 2; U6 7(~{INT1}/CLKOUT)*

### Notes on the sheet
- Integrated selectable load capacitors - default is 7pf
- Use 1225 Battery
- (in symbol S8201-46R) +; -

### Library data of the parts
C20 = CMP-08246-006760-1: as C13 on sheet microSD; Max Operating Temperature: 125°C; Lead Free: Lead Free; Min Operating Temperature: -55°C; Dielectric Material: Ceramic; Voltage Rating (DC): 6.3V; Case/Package: 0603; Thickness: 0.035inch; RoHS Compliant: Yes; Mount: Surface Mount; Width: 0.031inch; Tolerance: 10%; Case Code (Metric): 1608; Package Quantity: 4000; Series: C; Length: 0.063inch; Packaging: Tape and Reel
D6 = CMP-1051-00018-1: Schottky Barrier Diode, 2-Pin SOD-523, Pb-Free, Tape and Reel; Manufacturer: On Semiconductor; Configuration: Single; IFSM Max (A): 1; Mounting Technology: Surface Mount; ComponentLink1Description: Manufacturer URL; PackageReference: SOD-523-2-502-01; RoHS: TRUE; ComponentLink3Description: Package Specification; ComponentLink2Description: Datasheet; PackageVersion: Rev. E, 09/2010; PartNumber: RB521S30T1G; ComponentLink3URL: http://www.onsemi.com/pub_link/Collateral/502-01.PDF; ComponentLink1URL: http://www.onsemi.com/; PackageDescription: 2-Pin SOD, Body 1.2 x 0.8 mm; DatasheetVersion: Rev. 8; ComponentLink2URL: http://www.onsemi.cn/pub_link/Collateral/RB521S30T1-D.PDF; Packing: Tape and Reel
J3 = S8201-46R: Connector; Manufacturer_Name: Harwin; Datasheet Link: https://cdn.harwin.com/pdfs/S8201R.pdf; Manufacturer_Part_Number: S8201-46R; Mouser Part Number: 855-S8201-46R; Mouser Price/Stock: https://www.mouser.co.uk/ProductDetail/Harwin/S8201-46R?qs=UmERj8vReOlBAjlRZWzWbg%3D%3D
R23 = CMP-1659-00009-5: RES 1K OHM 1% 1/10W 0603; Voltage Rating: 50V; Power Rating: 100mW; Temperature Coefficient: 100ppm/°C; Military Standard: Not; REACH SVHC: No SVHC; Features: Moisture Resistant; Number of Terminations: 2; Technology: THICK FILM; Series: RC; Case Code (Metric): 1608; Resistance Tolerance: 1%; Resistor Type: Thick Film; Termination: SMD/SMT; Contact Plating: Tin; Radiation Hardening: No; Min Operating Temperature: -55°C; Max Operating Temperature: 155°C; Packaging: Tape and Reel; Max Power Dissipation: 100mW; RoHS Compliant: Yes; Height: 0.45mm; Lead Free: Lead Free; Case/Package: 0603; Length: 1.6mm; Tolerance: 1%; Case Code (Imperial): 0603; Construction: Rectangular; Depth: 0.8mm
R24 R25 = CMP-26527-000153-1: as R1 on sheet Processor; Tolerance: 5%; Series: RMCF; Resistor Type: Thick Film; Length: 0.061inch; Features: Automotive AEC-Q200; Height: 0.022inch; Case Code (Metric): 1608; Width: 0.031inch; Number of Terminations: 2; Contact Plating: Tin; Case/Package: 0603; Package Quantity: 1; Max Operating Temperature: 155°C; Mount: Surface Mount; RoHS Compliant: Yes; Radiation Hardening: No; Min Operating Temperature: -55°C; Packaging: Tape and Reel
U6 = CMP-10083-000004-1: IC RTC CLK/CALENDAR I2C 8-HVSON; Manufacturer: NXP Semiconductors; Standoff Height: 0mm; Nominal Supply Current: 0.15-1.2uA; Number Of Outputs: 1; Min Supply Voltage: 1V; Max Supply Voltage: 5.5V; Category: IC; Ipc Land Pattern Name: DFN400X400X100-8; Manufacturer Part Number: PCF8523TK/1,118; Temperature Range Low: -40°C; Automotive: No; Package: SOT909-1; Height: 1mm; Ambient Temperature Range High: +85°C; Digikey Description: IC RTC CLK/CALENDAR I2C 8-HVSON; Device Class L3: Real Time Clocks; Device Class L1: Integrated Circuits (ICs); Temperature Range High: +85°C; Device Class L2: Clock and Timing; Ambient Temperature Range Low: -40°C; Interface: I2C; Temperature: -40°C to +85°C; ComponentLink2Description: Datasheet; Octopart: https://octopart.com/pcf8523tk%2F1%2C118-nxp+semiconductors-19647992; Mouser Description: Real Time Clock REAL-TIME CLOCK (RTC) AND CALENDAR; Footprint Url: https://www.nxp.com/docs/en/package-information/SOT909-1.pdf; RoHS: TRUE; ComponentLink2URL: https://www.nxp.com/docs/en/data-sheet/PCF8523.pdf; Lead Free: Yes
Y2 = CM8V-T1A-32.768kHz-7pF-20PPM-TA-QC: Crystal or Oscillator; Manufacturer_Name: Micro Crystal AG; Datasheet Link: https://www.mouser.de/datasheet/2/530/CM8V_T1A-1510858.pdf; Height: 0.6mm; Manufacturer_Part_Number: CM8V-T1A-32.768kHz-7pF-20PPM-TA-QC; Mouser Part Number: 428-201436-MC01; Mouser Price/Stock: https://www.mouser.co.uk/ProductDetail/Micro-Crystal/CM8V-T1A-32.768kHz-7pF-20PPM-TA-QC?qs=7bTaA%2FLYtSYyZWzzv04BxA%3D%3D; Arrow Part Number: CM8V-T1A-32.768KHZ-7PF-20PPM-TA-QC; Arrow Price/Stock: https://www.arrow.com/en/products/cm8v-t1a-32.768khz-7pf-20ppm-ta-qc/micro-crystal-ag?region=nac

## Sheet USB_Interfaces.SchDoc
size A4; SheetNumber: 7; SheetTotal: 6
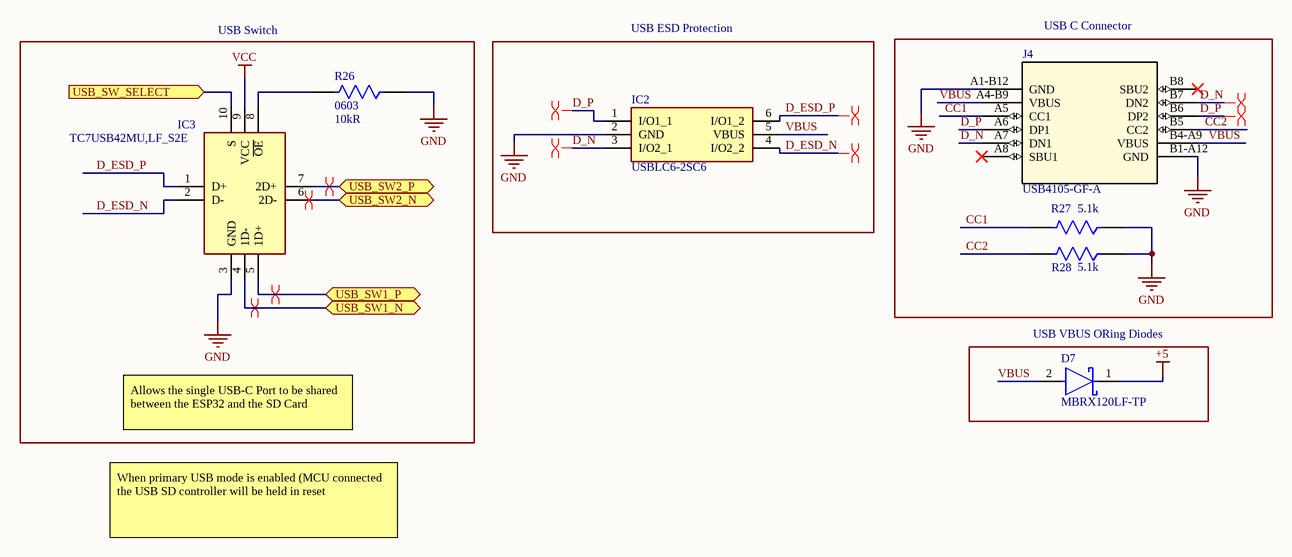
[diagram p5: USB_Interfaces.SchDoc]

### Parts
D7  MBRX120LF-TP  [FP-SOD-123-IPC_A]
IC2  USBLC6-2SC6  [SOT95P280X145-6N]
IC3  TC7USB42MU,LF_S2E  [TC7USB42MULFS2E]
J4  USB4105-GF-A  [USB4105_GCT]
R26  Case Code (Imperial): 0603  Resistance: 10kR  [FP-RMCF0603-MFG]  (hidden comment: RMCF0603JG10K0)
R27  Resistor: 5.1k  [FP-AC0603-MFG]  (hidden comment: AC0603FR-135K1L)
R28  Resistor: 5.1k  [FP-AC0603-MFG]  (hidden comment: AC0603FR-135K1L)

### Blocks framed on the sheet
USB Switch: IC3 R26
USB ESD Protection: IC2
USB C Connector: J4 R27 R28
USB VBUS ORing Diodes: D7

### Ports
USB_SW1_N (bidir), USB_SW1_P (bidir), USB_SW2_N (bidir), USB_SW2_P (bidir), USB_SW_SELECT (in)

### Nets
+5: D7.1(C)
GND: IC2.2(GND) IC3.3(GND) J4.A1-B12(GND) J4.B1-A12(GND) R26.1 R27.1 R28.1
VCC: IC3.9(VCC)
CC1: J4.A5(CC1) R27.2
CC2: J4.B5(CC2) R28.2
D_ESD_N: IC2.4(I/O2_2) IC3.2(D-)
D_ESD_P: IC2.6(I/O1_2) IC3.1(D+)
D_N: IC2.3(I/O2_1) J4.A7(DN1) J4.B7(DN2)
D_P: IC2.1(I/O1_1) J4.A6(DP1) J4.B6(DP2)
MCU_USB_N: IC3.4(1D-) ; port USB_SW1_N
MCU_USB_P: IC3.5(1D+) ; port USB_SW1_P
SD_RESET_N: IC3.10(S) ; port USB_SW_SELECT
SD_USB_N: IC3.6(2D-) ; port USB_SW2_N
SD_USB_P: IC3.7(2D+) ; port USB_SW2_P
VBUS: D7.2(A) IC2.5(VBUS) J4.A4-B9(VBUS) J4.B4-A9(VBUS)
NetIC3_8: IC3.8(~{OE}) R26.2

Not connected (* = marked no-connect by the designer): J4 A8(SBU1)* B8(SBU2)*

### Layout directives
differential pair: D_ESD_N, D_ESD_P, D_N, D_P, MCU_USB_N, MCU_USB_P, SD_USB_N, SD_USB_P

### Notes on the sheet
- Allows the single USB-C Port to be shared between the ESP32 and the SD Card
- When primary USB mode is enabled (MCU connected the USB SD controller will be held in reset

### Library data of the parts
D7 = CMP-56206-000012-1: DIODE SCHOTTKY 20V 1A SOD123; Max Power Dissipation: 556mW; Forward Voltage: 360mV; Peak Non-Repetitive Surge Current: 12A; Element Configuration: Single; Max Reverse Voltage (DC): 20V; Lead Free: Lead Free; Max Operating Temperature: 125°C; Radiation Hardening: No; Mount: Surface Mount; Number of Pins: 2; Average Rectified Current: 1A; Min Operating Temperature: -65°C; Max Repetitive Reverse Voltage (Vrrm): 20V; RoHS Compliant: Yes; Package Quantity: 1; Max Forward Surge Current (Ifsm): 12A; Packaging: Tape and Reel; Max Surge Current: 12A; Forward Current: 1A
IC2 = USBLC6-2SC6: Integrated Circuit; Manufacturer_Name: STMicroelectronics; Datasheet Link: http://www.st.com/st-web-ui/static/active/en/resource/technical/document/datasheet/CD00050750.pdf; Height: 1.45mm; Manufacturer_Part_Number: USBLC6-2SC6; Mouser Part Number: 511-USBLC6-2SC6; Mouser Price/Stock: https://www.mouser.co.uk/ProductDetail/STMicroelectronics/USBLC6-2SC6?qs=po45yt2pPpu%2FhNIlwQdTlg%3D%3D; Arrow Part Number: USBLC6-2SC6; Arrow Price/Stock: https://www.arrow.com/en/products/usblc6-2sc6/stmicroelectronics?region=nac
IC3 = TC7USB42MU,LF_S2E: Integrated Circuit; Manufacturer_Name: Toshiba; Manufacturer_Part_Number: TC7USB42MU,LF(S2E; Datasheet Link: https://toshiba.semicon-storage.com/ap-en/semiconductor/product/general-purpose-logic-ics/detail.TC7USB42MU.html; Height: 0.5mm; Mouser Part Number: 757-TC7USB42MULFS2E; Mouser Price/Stock: https://www.mouser.co.uk/ProductDetail/Toshiba/TC7USB42MULFS2E?qs=7D1LtPJG0i2u0rSmlbe57g%3D%3D
J4 = USB4105-GF-A: No Description Available; Mfr_Name: Global Connector Technology; Copyright: Copyright (C) 2022 Ultra Librarian. All rights reserved.; Manufacturer_Part_Number: USB4105-GF-A; Digi-Key_Part_Number_1: 2073-USB4105-GF-ACT-ND; Digi-Key_Part_Number_2: 2073-USB4105-GF-ADKR-ND; Digi-Key_Part_Number_3: 2073-USB4105-GF-ATR-ND; RefDes: RefDes; Type: DEV
R26 = CMP-26527-000153-1: as R1 on sheet Processor; Tolerance: 5%; Series: RMCF; Resistor Type: Thick Film; Length: 0.061inch; Features: Automotive AEC-Q200; Height: 0.022inch; Case Code (Metric): 1608; Width: 0.031inch; Number of Terminations: 2; Contact Plating: Tin; Case/Package: 0603; Package Quantity: 1; Max Operating Temperature: 155°C; Mount: Surface Mount; RoHS Compliant: Yes; Radiation Hardening: No; Min Operating Temperature: -55°C; Packaging: Tape and Reel
R27 R28 = CMP-03412-003579-2: RES 5.1KΩ 1.00% 0.1W 0603; RoHS Compliant: Yes

## Sheet Power.SchDoc
size A4; SheetNumber: 2; SheetTotal: 7
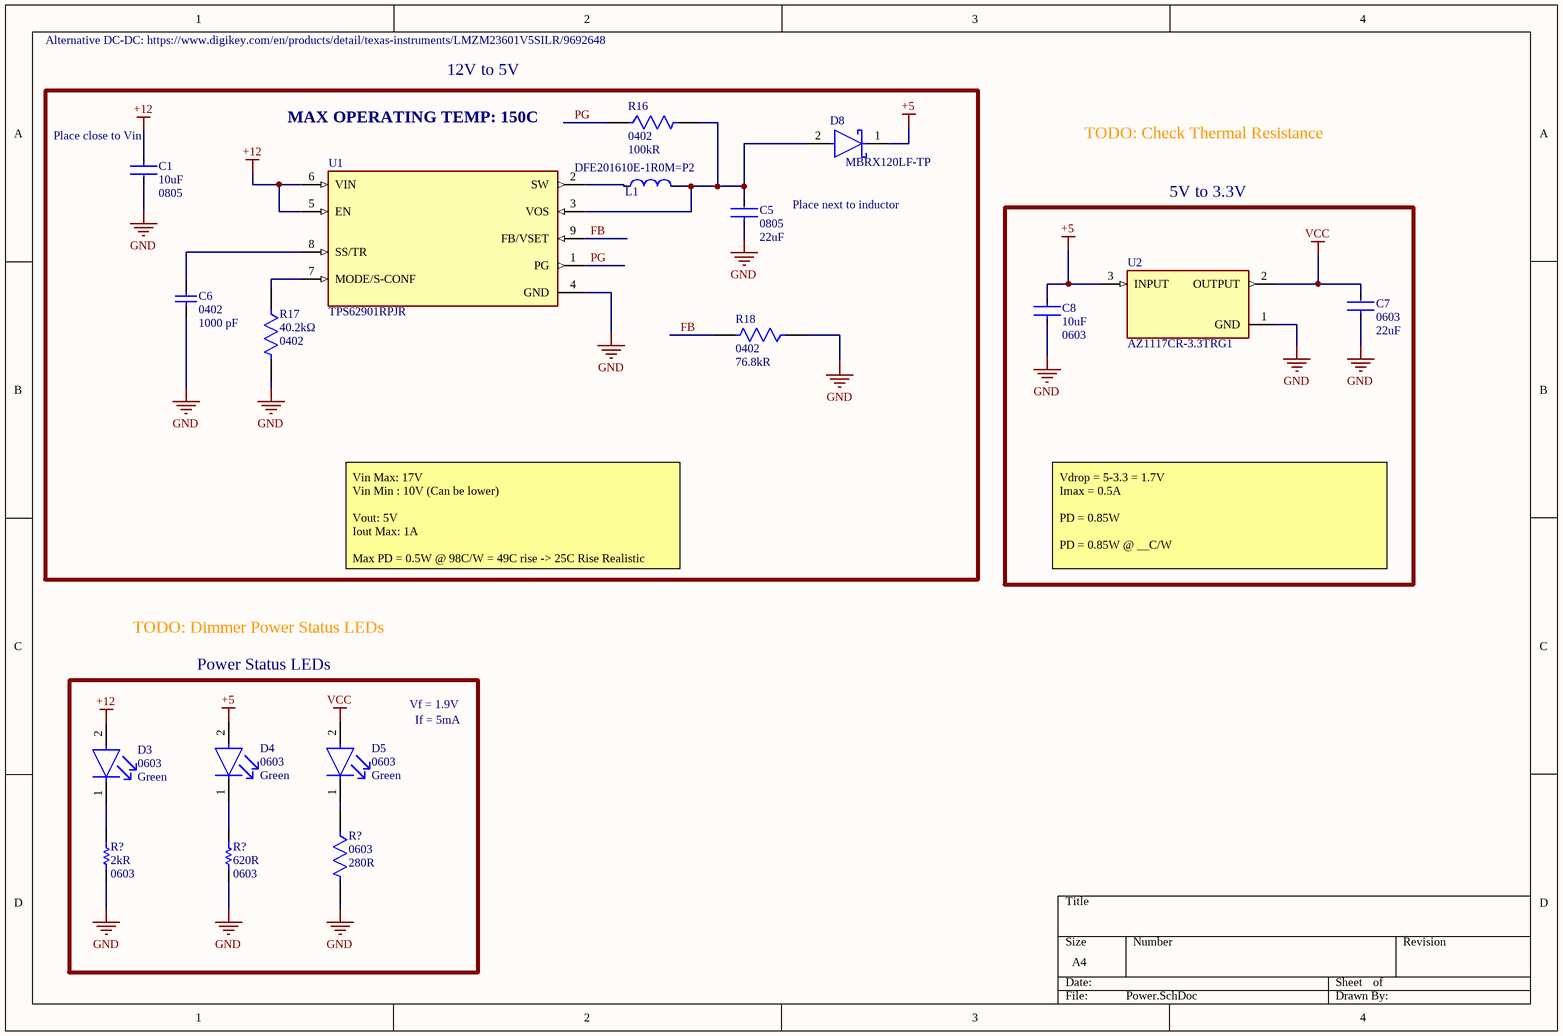
[diagram p6: Power.SchDoc]

### Parts
(Parts that share a designator on the sheet are numbered #1, #2 ... from top to bottom, then left to right.)
C1  Capacitance: 10uF  Case/Package: 0805  [FP-GRM21B-0_15-IPC_B]  (hidden comment: GRM21BR61E106KA73K)
C5  Case Code (Imperial): 0805  Capacitance: 22uF  [FP-GRM21B-0_2-e0_2_0_7-IPC_B]  (hidden comment: GRM21BD70J226ME44L)
C6  Package: 0402  Capacitance: 1000 pF  [CAPC1005X55X25ML05T10]  (hidden comment: GRM155R61A102KA01D)
C7  Case/Package: 0603  Capacitance: 22uF  [FP-GRM188-0_2-MFG]  (hidden comment: GRM188R60G226MEA0D)
C8  Capacitance: 10uF  Case/Package: 0603  [FP-CL10-IPC_C]  (hidden comment: CL10A106MQ8NNNC)
D3  Case Code (Imperial): 0603  Color: Green  [FP-LTST-C190KGKT-MFG]  (hidden comment: 12V)
D4  Case Code (Imperial): 0603  Color: Green  [FP-LTST-C190KGKT-MFG]  (hidden comment: 5V)
D5  Case Code (Imperial): 0603  Color: Green  [FP-LTST-C190KGKT-MFG]  (hidden comment: 3V3)
D8  MBRX120LF-TP  [FP-SOD-123-IPC_A]
L1  DFE201610E-1R0M=P2  [FP-DFE201610C-MFG]
R16  Case/Package: 0402  Resistance: 100kR  [FP-CRCW0402-e3-IPC_C]  (hidden comment: CRCW0402100KFKED)
R17  Resistance: 40.2kΩ  Case/Package: 0402  [FP-CRCW0402-Ce3-MFG]  (hidden comment: CRCW040240K2FKEDC)
R18  Case Code (Imperial): 0402  Resistance: 76.8kR  [FP-CRCW0402-e3-IPC_B]  (hidden comment: CRCW040276K8FKED)
R?#1  Case/Package: 0603  Resistance: 280R  [FP-RMCF0603-MFG]  (hidden comment: RMCF0603FT280R)
R?#2  Resistance: 2kR  Package: 0603  [RESC1608X55X30ML15T15]  (hidden comment: ERJ-3EKF2001V)
R?#3  Resistance: 620R  Package: 0603  [RESC1608X55X25ML10T15]  (hidden comment: RC0603FR-07620RL)
U1  TPS62901RPJR  [FP-RPJ0009A-MFG]
U2  AZ1117CR-3.3TRG1  [FP-SOT89-MFG]

### Blocks framed on the sheet
5V to 3.3V: C7 C8 U2
Power Status LEDs: D3-D5 R?#1-R?#3

### Nets
+5: C8.2 D4.2(A) D8.1(C) U2.3(INPUT)
+12: C1.1 D3.2(A) U1.5(EN) U1.6(VIN)
GND: C1.2 C5.1 C6.2 C7.1 C8.1 R17.2 R18.1 R?#1.2 R?#2.2 R?#3.2 U1.4(GND) U2.1(GND)
VCC: C7.2 D5.2(A) U2.2(OUTPUT)
FB: R18.2 U1.9(FB/VSET)
PG: R16.1 U1.1(PG)
NetC5_2: C5.2 D8.2(A) L1.2 R16.2 U1.3(VOS)
NetC6_1: C6.1 U1.8(SS/TR)
NetD3_1: D3.1(C) R?#2.1
NetD4_1: D4.1(C) R?#3.1
NetD5_1: D5.1(C) R?#1.1
NetL1_1: L1.1 U1.2(SW)
NetR17_1: R17.1 U1.7(MODE/S-CONF)

### Notes on the sheet
- Alternative DC-DC: https://www.digikey.com/en/products/detail/texas-instruments/LMZM23601V5SILR/9692648
- 12V to 5V
- (near C1) Place close to Vin
- MAX OPERATING TEMP: 150C
- TODO: Check Thermal Resistance
- Place next to inductor
- Vin Max: 17V
  Vin Min : 10V (Can be lower)
  Vout: 5V
  Iout Max: 1A
  Max PD = 0.5W @ 98C/W = 49C rise -> 25C Rise Realistic
- Vdrop = 5-3.3 = 1.7V
  Imax = 0.5A
  PD = 0.85W
  PD = 0.85W @ __C/W
- TODO: Dimmer Power Status LEDs
- Vf = 1.9V
- If = 5mA

### Library data of the parts
C1 = CMP-06035-004844-1: Chip Multilayer Ceramic Capacitors for General Purpose, 0805, 10uF, X5R, 15%, 10%, 25V; Max Operating Temperature: 85°C; Min Operating Temperature: -55°C; Package Quantity: 10000; Weight: 0.000335oz; Voltage Rating: 25V; Tolerance: 10%; Voltage Rating (DC): 25V; Mount: Surface Mount; Length: 0.079inch; Packaging: Tape and Reel; Dielectric: X5R; Width: 0.049inch; Thickness: 0.055inch
C5 = CMP-06035-048447-1: Chip Multilayer Ceramic Capacitors for General Purpose, 0805, 22uF, X7T, +22%/-33%, 20%, 6.3V; Mount: Surface Mount; Packaging: Tape and Reel; Voltage Rating: 6.3V; Height: 1.25mm; Voltage Rating (DC): 6.3V; Case/Package: 0805; Weight: 0.000335oz; Dielectric: X7T; Length: 0.079inch; Width: 1.25mm; Package Quantity: 3000; Thickness: 0.057inch; Tolerance: 20%; Min Operating Temperature: -55°C; Case Code (Metric): 2012; Termination: SMD/SMT; Max Operating Temperature: 125°C; Resistor Type: Ceramic
C6 = CMP-2008-04555-1: Manufacturer: Murata; Part Number: GRM155R61A102KA01D
C7 = CMP-2006-02788-2: Chip Multilayer Ceramic Capacitors for General Purpose, 0603, 22uF, X5R, 15%, 20%, 4V; Package Quantity: 4000; Lead Free: Lead Free; Material: Ceramic; Height: 0.8mm; Length: 1.6mm; REACH SVHC: No SVHC; Voltage Rating: 4V; Depth: 0.8mm; Case Code (Metric): 1608; Voltage: 4V; Dielectric: X5R; Width: 0.8mm; Max Operating Temperature: 85°C; Tolerance: 20%; Packaging: Tape and Reel; Case Code (Imperial): 0603; Voltage Rating (DC): 4V; Thickness: 0.035inch; Mount: Surface Mount; Min Operating Temperature: -55°C; Radiation Hardening: No; Termination: SMD/SMT
C8 = CMP-13271-001938-1: Cap Ceramic 10uF 6.3V X5R ±20% Pad SMD 0603 +85°C T/R; Contact Plating: Tin; Height: 0.8mm; Width: 0.031inch; Min Operating Temperature: -55°C; Dielectric: X5R; Voltage Rating: 6.3V; Package Quantity: 1; Radiation Hardening: No; Packaging: Tape and Reel; Max Operating Temperature: 85°C; Voltage: 6.3V; Thickness: 0.035inch; Mount: Surface Mount; Case Code (Imperial): 0603; Case Code (Metric): 1608; Depth: 0.8mm; Tolerance: 20%; Length: 1.6mm
D3 D5 = CMP-2000-05197-2: LED GREEN CLEAR CHIP SMD; Test Current: 20mA; Power Rating: 75mW; Forward Voltage: 2V; Wavelength: 574nm; Number of LEDs: 1; Reverse Voltage: 5V; Dominant Wavelength: 571nm; Lens Style: Diffused; Luminous Intensity: 35mcd; Forward Current: 30mA; Viewing Angle: 130°; Lens Color: Colorless; Width: 0.8mm; Case Code (Metric): 1608; Number of Pins: 2; Radiation Hardening: No; Package Quantity: 1; Lead Free: Lead Free; Lens Transparency: Clear; Depth: 0.8mm; Power Dissipation: 75mW; Mount: Surface Mount; Max Operating Temperature: 85°C; Case/Package: 0603; Height: 0.8mm; Illumination Color: Green; Length: 1.6mm; Packaging: Tape and Reel; Number of Elements: 1; Min Operating Temperature: -55°C
D4 = CMP-2000-05197-2: LED GREEN CLEAR CHIP SMD; Test Current: 20mA; Power Rating: 75mW; Forward Voltage: 2V; Wavelength: 574nm; Number of LEDs: 1; Dominant Wavelength: 571nm; Lens Style: Diffused; Luminous Intensity: 35mcd; Forward Current: 30mA; Viewing Angle: 130°; Lens Color: Colorless; Width: 0.8mm; Case Code (Metric): 1608; Number of Pins: 2; Radiation Hardening: No; Package Quantity: 1; Lead Free: Lead Free; Lens Transparency: Clear; Depth: 0.8mm; Power Dissipation: 75mW; Reverse Voltage: 5V; Mount: Surface Mount; Max Operating Temperature: 85°C; Case/Package: 0603; Height: 0.8mm; Illumination Color: Green; Length: 1.6mm; Packaging: Tape and Reel; Number of Elements: 1; Min Operating Temperature: -55°C
D8 = CMP-56206-000012-1: as D7 on sheet USB_Interfaces; Max Reverse Voltage (DC): 20V; Lead Free: Lead Free; Max Operating Temperature: 125°C; Radiation Hardening: No; Mount: Surface Mount; Number of Pins: 2; Average Rectified Current: 1A; Min Operating Temperature: -65°C; Max Repetitive Reverse Voltage (Vrrm): 20V; RoHS Compliant: Yes; Package Quantity: 1; Max Forward Surge Current (Ifsm): 12A; Packaging: Tape and Reel; Max Surge Current: 12A; Forward Current: 1A
L1 = CMP-06042-015199-1: Shielded Wirewound Inductor 1uH 20% 2700mA 0.057Ω 0806 (2016)
R16 = CMP-2002-08123-3: RES Thick Film, 100kΩ, 1%, 0.063W, 100ppm/°C, 0402; Power Rating: 63mW; Voltage Rating (DC): 50V; Lead Free: Lead Free; Height: 0.35mm; Contact Plating: Tin; Min Operating Temperature: -55°C; Package Quantity: 10000; Temperature Coefficient: 100ppm/°C; Number of Terminations: 2; Packaging: Tape and Reel; Max Power Dissipation: 63mW; Case Code (Metric): 1005; Mount: Surface Mount; Width: 0.02inch; Termination: SMD/SMT; Length: 1mm; Number of Pins: 2; Weight: 2.3E-05oz; Radiation Hardening: No; Tolerance: 1%; Military Standard: Not; Features: Automotive AEC-Q200; Depth: 0.5mm; Composition: Thick Film; Max Operating Temperature: 155°C; Voltage Rating: 50V; Case Code (Imperial): 0402
R17 = CMP-00030-23798208-3: CRCW040240K2FKEDC SMD Chip Resistor, 40.2 kOhm, ± 1%, 63 mW, 0402 [1005 Metric], Thick Film, General Purpose; Voltage Rating: 50V; Temperature Coefficient: 100ppm/°C; Power Rating: 63mW; NexarPartId: 23798208; Schedule B: 8533210045, 8533210045; Composition: Thick Film; RoHS: Compliant; Max Operating Temperature: 155°C; Height: 350µm; Number of Pins: 2; Tolerance: 1%; Lead Free: Lead Free; Min Operating Temperature: -55°C
R18 = CMP-2002-00214-2: RES Thick Film, 76.8kΩ, 1%, 0.063W, 100ppm/°C, 0402; Voltage Rating (DC): 50V; Max Power Dissipation: 63mW; Width: 0.5mm; Contact Plating: Tin; Case Code (Metric): 1005; Weight: 2.3E-05oz; Depth: 0.5mm; Height: 0.016inch; Termination: SMD/SMT; Military Standard: Not; Length: 1mm; Case/Package: 0402; Max Operating Temperature: 155°C; Radiation Hardening: No; Lead Free: Lead Free; Tolerance: 1%; Features: Automotive AEC-Q200; Min Operating Temperature: -55°C; Temperature Coefficient: 100ppm/°C; Power Rating: 63mW; Number of Terminations: 2; Voltage Rating: 50V; Package Quantity: 10; Packaging: Tape and Reel; Composition: Thick Film
R?#1 = CMP-26527-006784-1: as R3 on sheet Processor; RoHS Compliant: Yes; Height: 0.022inch; Resistor Type: Thick Film; Case Code (Metric): 1608; Radiation Hardening: No; Contact Plating: Tin; Series: RMCF; Features: Automotive AEC-Q200; Number of Terminations: 2; Tolerance: 1%; Packaging: Tape and Reel; Max Operating Temperature: 155°C; Min Operating Temperature: -55°C; Length: 0.061inch; Lead Free: Lead Free; Width: 0.031inch; Mount: Surface Mount; Case Code (Imperial): 0603
R?#2 = CMP-2000-00317-1: Manufacturer: Panasonic; Part Number: ERJ-3EKF2001V
R?#3 = CMP-2000-04103-1: Manufacturer: Yageo; Part Number: RC0603FR-07620RL
U1 = CMP-04918-000584-1: 3-V TO 17-V, 1-A, HIGH-EFFICIENC
U2 = CMP-12756-000007-1: IC REG LINEAR 3.3V 800MA SOT89; Manufacturer: Diodes Inc.; Nominal Supply Current: 4mA; Output Type: Fixed; Accuracy Percentage: 1%; Max Junction Temp: +125°C; Max Supply Voltage: 15V; Number Of Outputs: 1; Output Current: 1.35A; Dropout Voltage: 1.2V; Device Class L1: Integrated Circuits (ICs); ComponentLink2URL: https://www.diodes.com/assets/Datasheets/AZ1117C.pdf; Temperature Range High: +125°C; Octopart: https://octopart.com/az1117cr-3.3trg1-diodes+inc.-30954805; Output Voltage: 3.3V; Automotive: No; RoHS: TRUE; Temperature Range Low: -20°C; Package: SOT89; Height: 1.6mm; Mouser Description: DiodesZetex AZ1117CR-3.3TRG1, LDO Regulator, 800mA, 3.3 V, ±1% 3-Pin, SOT-89; Manufacturer Part Number: AZ1117CR-3.3TRG1; ComponentLink2Description: Datasheet; Device Class L2: Power Management ICs; Lead Free: Yes; Device Class L3: Voltage Regulators - Linear; Category: IC; Temperature: -20°C to +125°C; Footprint Url: https://www.diodes.com/assets/Package-Files/SOT89.pdf; Digikey Description: IC REG LINEAR 3.3V 800MA SOT89

## Nets that join several sheets
+5: USB_Interfaces (D7.1), Power (C8.2 D4.2 D8.1 U2.3)
+12: CAN (J1.9), Power (C1.1 D3.2 U1.5 U1.6)
GND: Processor (37 pins), microSD (19 pins), CAN (11 pins), RTC (C20.1 J3.2 U6.4 U6.9), USB_Interfaces (7 pins), Power (12 pins)
VCC: Processor (6 pins), microSD (16 pins), CAN (C11.2 C19.2 U4.3 U5.3), RTC (R23.1 R24.2 R25.1), USB_Interfaces (IC3.9), Power (C7.2 D5.2 U2.2)
MCU_USB_N: Processor (IC1.17), USB_Interfaces (IC3.4)
MCU_USB_P: Processor (IC1.18), USB_Interfaces (IC3.5)
NetIC1_9: Processor (IC1.9), CAN (U4.1)
NetIC1_10: Processor (IC1.10), CAN (U4.4)
NetIC1_12: Processor (IC1.12), CAN (U5.1)
NetIC1_13: Processor (IC1.13), CAN (U5.4)
RTC_SCL: Processor (IC1.19), RTC (R25.2 U6.6)
RTC_SDA: Processor (IC1.20), RTC (R24.1 U6.5)
SD_CLK: Processor (IC1.25), microSD (J2.5 R10.1 U3.9)
SD_CMD: Processor (IC1.24), microSD (J2.3 R9.1 U3.11)
SD_D0: Processor (IC1.26), microSD (J2.7 R5.1 U3.5)
SD_D1: Processor (IC1.27), microSD (J2.8 R6.1 U3.4)
SD_D2: Processor (IC1.28), microSD (J2.1 R7.1 U3.25)
SD_D3: Processor (IC1.29), microSD (J2.2 R8.1 U3.23)
SD_RESET_N: Processor (IC1.5), microSD (U3.18), USB_Interfaces (IC3.10)
SD_USB_N: microSD (U3.3), USB_Interfaces (IC3.6)
SD_USB_P: microSD (U3.2), USB_Interfaces (IC3.7)